# EasyEDA Pro project TB6612-4路电机驱动.epro

# Schematic Schematic1
Board Name: Board1; Create Date: 2025-07-07; Page Name: P1; Project Name: TB6612-4路电机驱动; Schematic Name: Schematic1; Update Date: 2025-07-07; Company: 嘉立创EDA; Page Size: A4; Version: V1.0
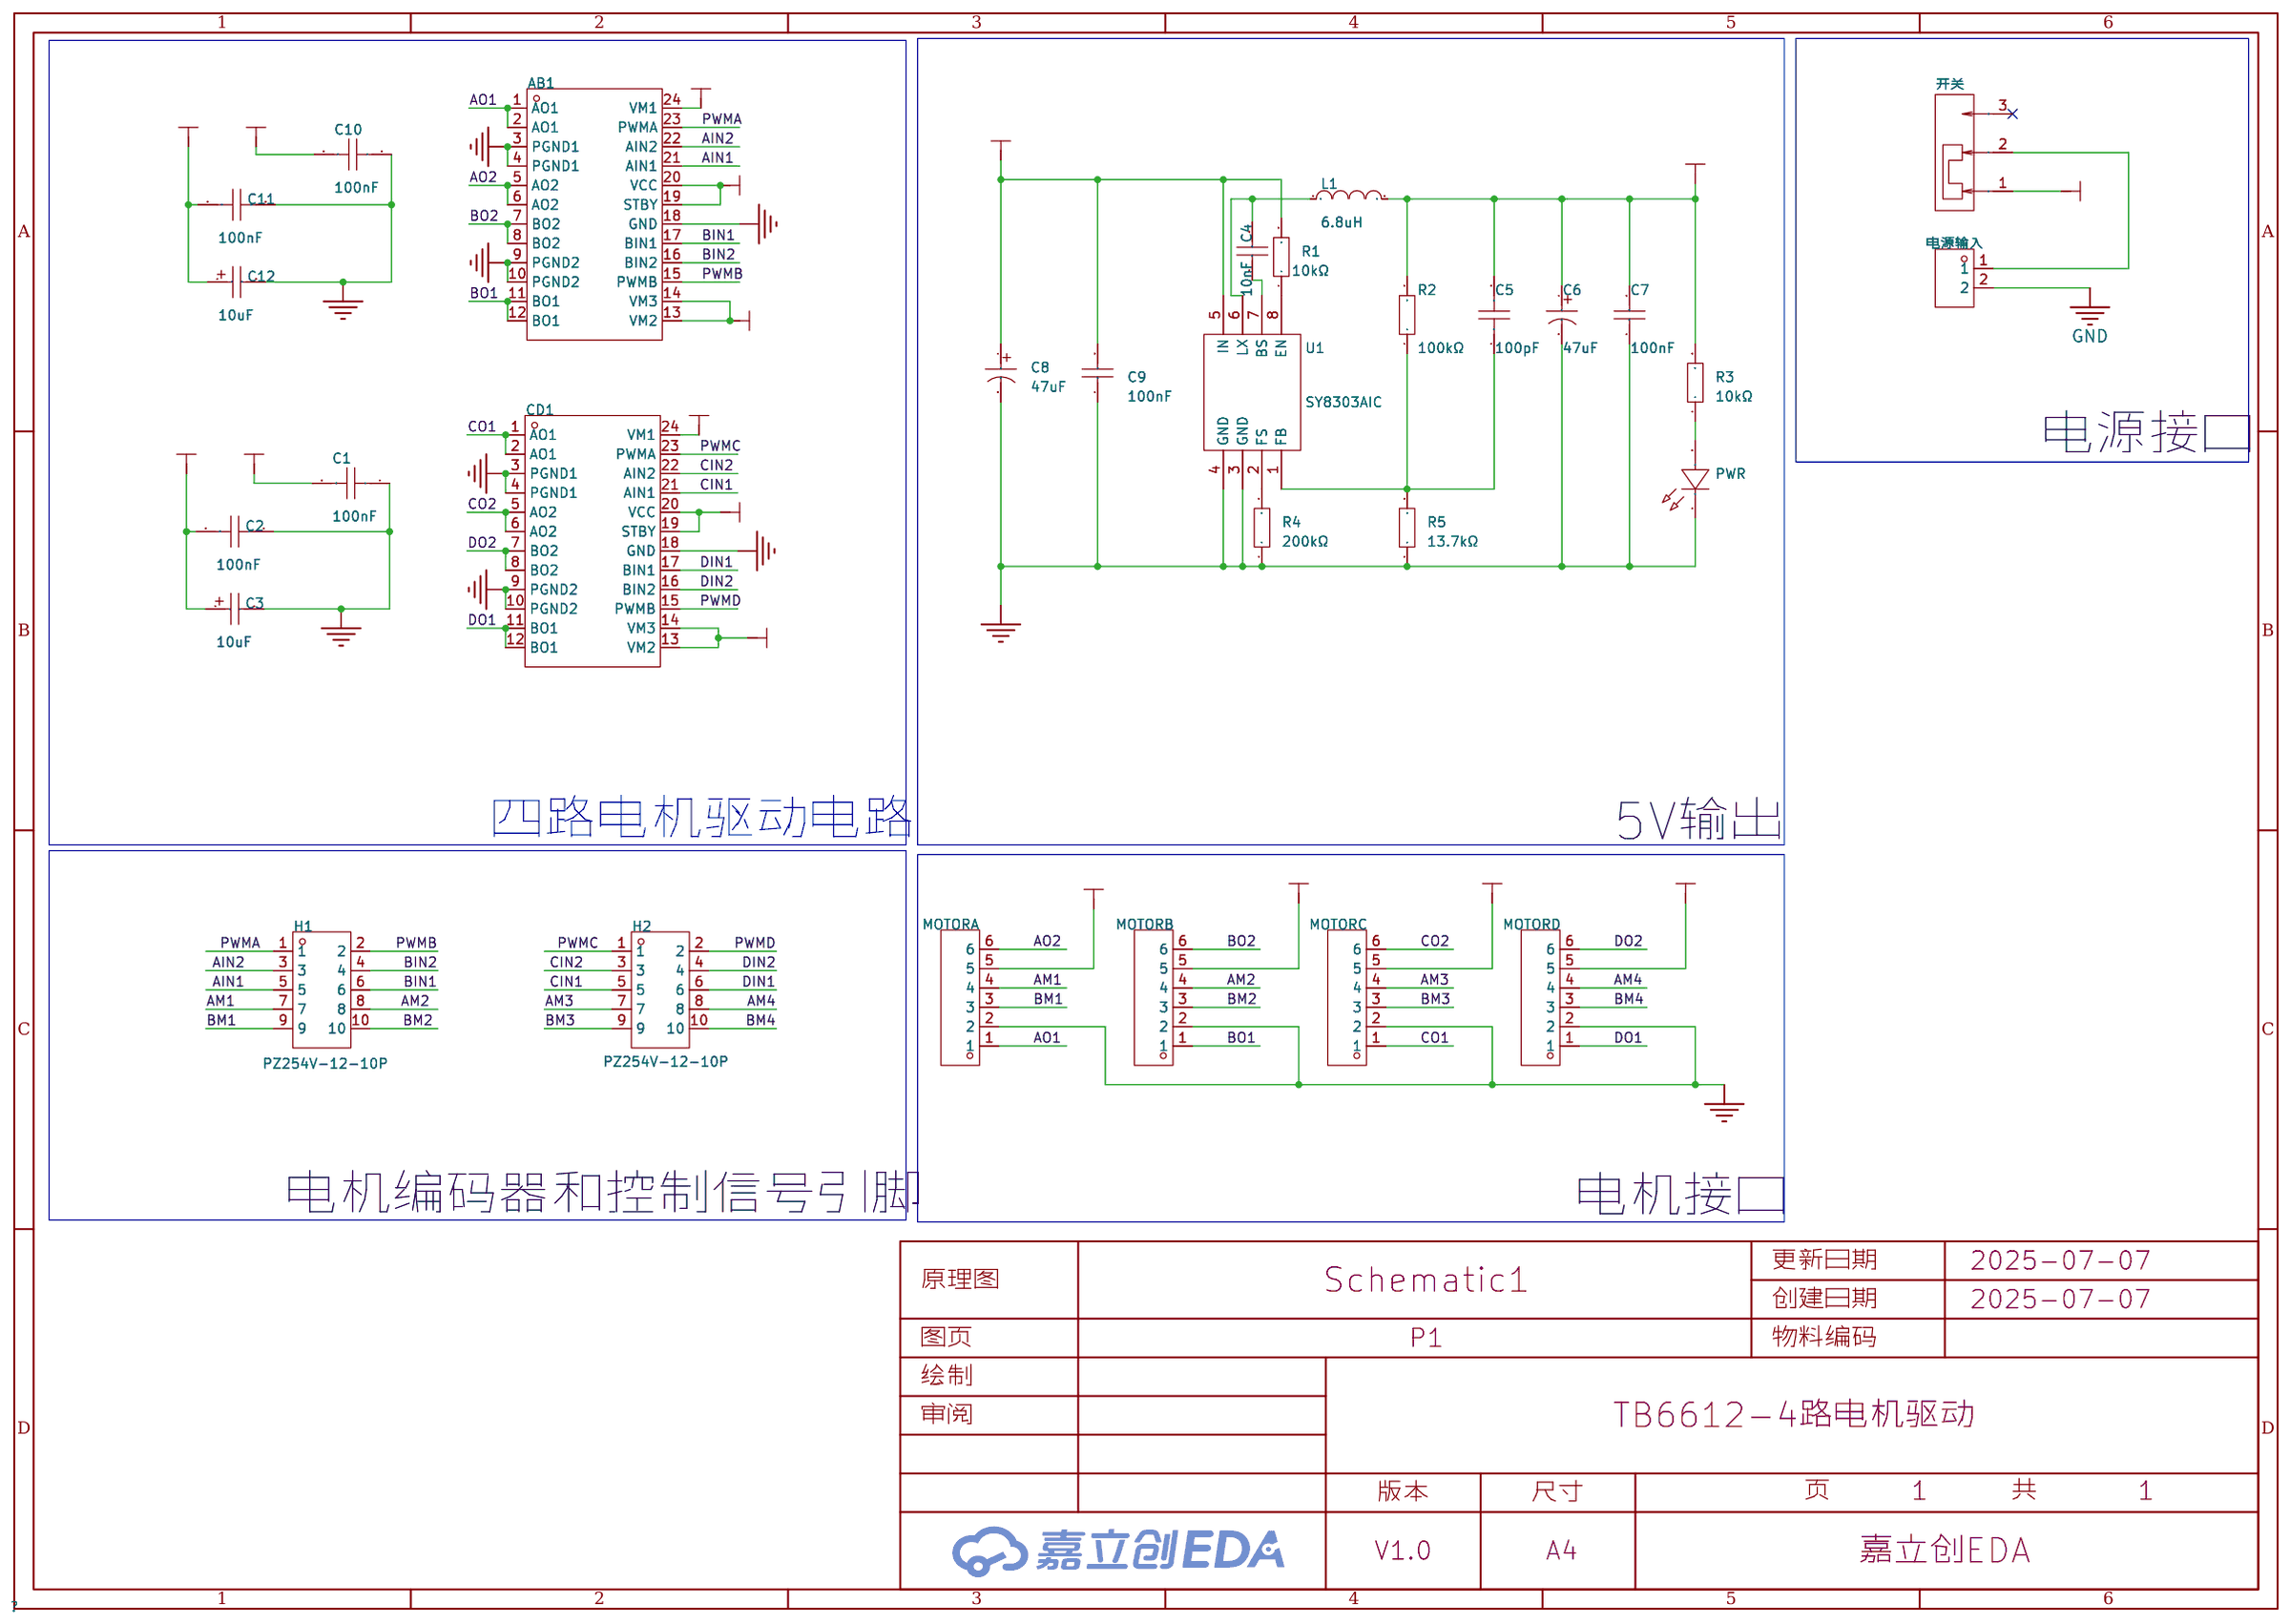
[diagram p0: schematic sheet]

## Parts
AB1  TB6612FNG(O,C,8,EL  [SSOP-24_L8.4-W5.8-P0.65-LS7.8-BL]
C1  100nF  [C0603]
C2  100nF  [C0603]
C3  10uF  [CAP-SMD_L3.5-W2.8-R-RD]
C4  10nF  [C0603]
C5  100pF  [C0603]
C6  47uF  [CAP-SMD_BD6.3-L6.6-W6.6-LS7.6-FD]
C7  100nF  [C0603]
C8  47uF  [CAP-SMD_BD6.3-L6.6-W6.6-LS7.6-FD]
C9  100nF  [C0603]
C10  100nF  [C0603]
C11  100nF  [C0603]
C12  10uF  [CAP-SMD_L3.5-W2.8-R-RD]
CD1  TB6612FNG(O,C,8,EL  [SSOP-24_L8.4-W5.8-P0.65-LS7.8-BL]
H1  PZ254V-12-10P  [HDR-TH_10P-P2.54-V-M-R2-C5-S2.54]
H2  PZ254V-12-10P  [HDR-TH_10P-P2.54-V-M-R2-C5-S2.54]
L1  6.8uH  [IND-SMD_L4.4-W4.2]
MOTORA  X8821WR-06S-N0SN  [CONN-TH_6P-P2.50_X8821WR-06S-N2SN]
MOTORB  X8821WR-06S-N0SN  [CONN-TH_6P-P2.50_X8821WR-06S-N2SN]
MOTORC  X8821WR-06S-N0SN  [CONN-TH_6P-P2.50_X8821WR-06S-N2SN]
MOTORD  X8821WR-06S-N0SN  [CONN-TH_6P-P2.50_X8821WR-06S-N2SN]
PWR  XL-1608UGC-04  [LED0603-RD_GREEN]
R1  10kΩ  [R0603]
R2  100kΩ  [R0603]
R3  10kΩ  [R0603]
R4  200kΩ  [R0603]
R5  13.7kΩ  [R0603]
U1  SY8303AIC  [TSOT-23-8_L2.9-W1.6-P0.65-LS2.8-BR]
开关  SS-12D10-G5  [SW-TH_SS-12D10-G050]
电源输入  KF301-5.0-2P  [CONN-TH_P5.00_KF301-5.0-2P]

## Library data of the parts
AB1 CD1 = TB6612FNG(O,C,8,EL: 双直流电机驱动器集成电路; Supplier Part: C88224; Manufacturer: TOSHIBA(东芝); Supplier Footprint: SSOP-24-208mil; JLCPCB Part Class: 扩展库; Datasheet: https://atta.szlcsc.com/upload/public/pdf/source/20171128/C141517_15118625624231147036.pdf; Supplier: LCSC
C1 C2 C10 C11 = CL10B104KB8NNNC: 容值:100nF;精度:±10%;额定电压:50V;材质(温度系数):X7R;; LCSC Part Name: 100nF ±10% 50V; Supplier Part: C1591; Manufacturer: SAMSUNG(三星); Supplier Footprint: 0603; JLCPCB Part Class: 扩展库; Datasheet: https://atta.szlcsc.com/upload/public/pdf/source/20160218/1457707763339.pdf; Supplier: LCSC; Tolerance: ±10%; Voltage Rated: 50V; Temperature Coefficient: X7R
C3 C12 = TAJB106K025RNJ: 容值:10uF;精度:±10%;额定电压:25V;等效串联电阻:2.5Ω@100kHz;; LCSC Part Name: 10uF ±10% 25V; Supplier Part: C7194; Manufacturer: Kyocera AVX; Supplier Footprint: CASE-B-3528; JLCPCB Part Class: 扩展库; Datasheet: https://atta.szlcsc.com/upload/public/pdf/source/20160107/1457707750344.pdf; Supplier: LCSC; Tolerance: ±10%; Rated Voltage: 25V; Equivalent Series Resistance(ESR): 2.5Ω@100kHz; Operating Temperature: -55℃~+125℃
C4 = CC0603KRX7R9BB103: 容值:10nF;精度:±10%;额定电压:50V;材质(温度系数):X7R;; LCSC Part Name: 10nF ±10% 50V; Supplier Part: C100042; Manufacturer: YAGEO(国巨); Supplier Footprint: 0603; JLCPCB Part Class: 扩展库; Datasheet: https://atta.szlcsc.com/upload/public/pdf/source/20181008/C309510_22F155564471FAF6A489F7D68F34234E.pdf; Supplier: LCSC; Tolerance: ±10%; Voltage Rated: 50V; Temperature Coefficient: X7R
C5 = CC0603JRNPO9BN101: 容值:100pF;精度:±5%;额定电压:50V;材质(温度系数):NP0;; LCSC Part Name: 100pF ±5% 50V; Supplier Part: C14665; Manufacturer: YAGEO(国巨); Supplier Footprint: 0603; JLCPCB Part Class: 扩展库; Datasheet: https://atta.szlcsc.com/upload/public/pdf/source/20181008/C309499_21CC21451B82C39E3D92150FD6B30293.pdf; Supplier: LCSC; Tolerance: ±5%; Voltage Rated: 50V; Temperature Coefficient: NP0
C6 C8 = RVT1H470M0607_C72523: 容值:47uF;精度:±20%;额定电压:50V;纹波电流:66mA@120Hz;等效串联电阻:-;; LCSC Part Name: 47uF ±20% 50V; Supplier Part: C72523; Manufacturer: ROQANG(容强); Manufacturer Part: RVT1H470M0607; Supplier Footprint: SMD,D6.3xL7.7mm; JLCPCB Part Class: 扩展库; Datasheet: https://atta.szlcsc.com/upload/public/pdf/source/20170325/1490427950282.pdf; Supplier: LCSC; Tolerance: ±20%; Rated Voltage: 50V; Ripple Current: 66mA@120Hz; φD: 6.3mm; L: 7.7mm; Lifetime @ Temp: 2000hrs@105℃; Operating Temperature: -40℃~+105℃
C7 C9 = 0603B104K500NT: 容值:100nF;精度:±10%;额定电压:50V;材质(温度系数):X7R;; LCSC Part Name: 100nF ±10% 50V; Supplier Part: C30926; Manufacturer: FH(风华); Supplier Footprint: 0603; JLCPCB Part Class: 扩展库; Datasheet: https://atta.szlcsc.com/upload/public/pdf/source/20200305/C486355_26A10D38EF8C2A5C37091D0039909270.pdf; Supplier: LCSC; Tolerance: ±10%; Voltage Rated: 50V; Temperature Coefficient: X7R
H1 H2 = PZ254V-12-10P: 插针结构:2x5P;间距:2.54mm;行距:2.54mm;圆针/方针:方针;安装类型:直插;排数:双排;总PIN位数:10P;额定电流:-;额定电压:-;配合针长度:6mm;塑高:2.5mm;端接针长度:3mm;触头材质:黄铜;触头镀层:-;工作温度范围:-40℃~+105℃;颜色:黑色;; LCSC Part Name: 间距:2.54mm 2x5P 直插 方针; Supplier Part: C492422; Manufacturer: XFCN(兴飞); Supplier Footprint: 插件,P=2.54mm; JLCPCB Part Class: 扩展库; Datasheet: https://atta.szlcsc.com/upload/public/pdf/source/20200309/C492422_5020CEA01BE7051F9EA9DD81AB0A25E3.pdf; Supplier: LCSC; Pin Structure: 2x5P; Pitch: 2.54mm; Row Spacing: 2.54mm; Circluar Pins/Square Pins: 方针; Mounting Type: 直插; Number of Rows: 双排; Number of Pins: 10P; Length of Mating Pin: 6mm; Insulation Height: 2.5mm; Length of End Connection Pin: 3mm; Contact Material: 黄铜; Operating Temperature Range: -40℃~+105℃; Color: 黑色
L1 = FXL0420-6R8-M: 电感值:6.8uH;精度:±20%;额定电流:2.4A;饱和电流(Isat):2.5A;类型:一体成型电感;; LCSC Part Name: 6.8uH ±20% 2.5A; Supplier Part: C177241; Manufacturer: cjiang(长江微电); Supplier Footprint: SMD,4.2x4.4mm; JLCPCB Part Class: 扩展库; Datasheet: https://atta.szlcsc.com/upload/public/pdf/source/20200117/C485363_A2440626DC7482D75DD0DD56D1883FBF.pdf; Supplier: LCSC; Tolerance: ±20%; Rated Current: 2.4A; Saturation Current (Isat): 2.5A; DC Resistance (DCR): 175mΩ; Type: 一体成型电感
MOTORA MOTORB MOTORC MOTORD = X8821WR-06S-N0SN: 插针结构:1x6P;间距:2.5mm;安装方式:弯插;参考系列:XH;总PIN数:6P;排数:1;每排PIN数:6;行距:-;额定电流:3A;触头材质:黄铜;触头镀层:锡;工作温度范围:-;; LCSC Part Name: 1x6P 间距:2.5mm 弯插 系列:XH; Supplier Part: C388743; Manufacturer: XKB Connection(中国星坤); Supplier Footprint: 弯插,P=2.54mm; JLCPCB Part Class: 扩展库; Datasheet: https://atta.szlcsc.com/upload/public/pdf/source/20211009/984C14C41D2B1156BCF8EEF5D296E395.pdf; Supplier: LCSC; Pins Structure: 1x6P; Pitch: 2.5mm; Mounting Style: 弯插; Reference Series: XH; Number of Pins: 6P; Number of Rows: 1; Number of PINs Per Row: 6; Current Rating (Max): 3A; Contact Material: 黄铜; Contact Plating: 锡
PWR = XL-1608UGC-04: 灯头类型:-;发光颜色:翠绿色;正向电压(VF):-;功率:80mW;正向电流:25mA;主波长:516nm~525nm;二极管配置:独立二极管;透镜颜色:无色透明透镜;色温:-;发光强度:-;发光角度:120°;载带方式:正贴;工作温度:-30℃~+85℃;; Supplier Part: C965804; Manufacturer: XINGLIGHT(成兴光); Supplier Footprint: 0603; JLCPCB Part Class: 扩展库; Datasheet: https://atta.szlcsc.com/upload/public/pdf/source/20221102/520D6E465E5CFD1609C8A4DBC80D4018.pdf; Supplier: LCSC; Emitted Color: 翠绿色; Power Dissipation: 80mW; Forward Current: 25mA; Dominant Wavelength: 516nm~525nm; Peak Wavelength: 534nm; Diode Configuration: 独立二极管; Lens Color: 无色透明透镜; Viewing Angle: 120°; Mounting Sytle: 正贴; Operating Temperature: -30℃~+85℃
R1 R3 = 0603WAF1002T5E: 电阻类型:厚膜电阻;阻值:10kΩ;精度:±1%;功率:100mW;最大工作电压:75V;温度系数:±100ppm/℃;; LCSC Part Name: 厚膜电阻 10kΩ ±1% 100mW; Supplier Part: C25804; Manufacturer: UNI-ROYAL(厚声); Supplier Footprint: 0603; JLCPCB Part Class: 基础库; Datasheet: https://atta.szlcsc.com/upload/public/pdf/source/20200306/C422600_1E6D84923E4A46A82E41ADD87F860B5C.pdf; Supplier: LCSC; Type: 厚膜电阻; Tolerance: ±1%; Power(Watts): 100mW; Overload Voltage (Max): 75V; Temperature Coefficient: ±100ppm/℃; Operating Temperature Range: -55℃~+155℃
R2 = 0603WAF1003T5E: 电阻类型:厚膜电阻;阻值:100kΩ;精度:±1%;功率:100mW;最大工作电压:75V;温度系数:±100ppm/℃;; LCSC Part Name: 100kΩ ±1% 100mW 厚膜电阻; Supplier Part: C25803; Manufacturer: UNI-ROYAL(厚声); Supplier Footprint: 0603; JLCPCB Part Class: 基础库; Datasheet: https://atta.szlcsc.com/upload/public/pdf/source/20200306/C422600_1E6D84923E4A46A82E41ADD87F860B5C.pdf; Supplier: LCSC; Type: 厚膜电阻; Tolerance: ±1%; Power(Watts): 100mW; Overload Voltage (Max): 75V; Temperature Coefficient: ±100ppm/℃; Operating Temperature Range: -55℃~+155℃
R4 = 0603WAF2003T5E: 电阻类型:厚膜电阻;阻值:200kΩ;精度:±1%;功率:100mW;最大工作电压:75V;温度系数:±100ppm/℃;; LCSC Part Name: 200kΩ ±1% 100mW 厚膜电阻; Supplier Part: C25811; Manufacturer: UNI-ROYAL(厚声); Supplier Footprint: 0603; JLCPCB Part Class: 基础库; Datasheet: https://atta.szlcsc.com/upload/public/pdf/source/20200306/C422600_1E6D84923E4A46A82E41ADD87F860B5C.pdf; Supplier: LCSC; Type: 厚膜电阻; Tolerance: ±1%; Power(Watts): 100mW; Overload Voltage (Max): 75V; Temperature Coefficient: ±100ppm/℃; Operating Temperature Range: -55℃~+155℃
R5 = 0603WAF1372T5E: 电阻类型:厚膜电阻;阻值:13.7kΩ;精度:±1%;功率:100mW;最大工作电压:75V;温度系数:±100ppm/℃;; LCSC Part Name: 13.7kΩ ±1% 100mW 厚膜电阻; Supplier Part: C22793; Manufacturer: UNI-ROYAL(厚声); Supplier Footprint: 0603; JLCPCB Part Class: 扩展库; Datasheet: https://atta.szlcsc.com/upload/public/pdf/source/20200306/C422600_1E6D84923E4A46A82E41ADD87F860B5C.pdf; Supplier: LCSC; Type: 厚膜电阻; Tolerance: ±1%; Power(Watts): 100mW; Overload Voltage (Max): 75V; Temperature Coefficient: ±100ppm/℃; Operating Temperature Range: -55℃~+155℃
U1 = SY8303AIC: 功能类型:降压型;输入电压:-;输出电流(最大值):-;; Supplier Part: C97054; Manufacturer: silergy(矽力杰); Supplier Footprint: TSOT-23-8; JLCPCB Part Class: 扩展库; Datasheet: https://atta.szlcsc.com/upload/public/pdf/source/20170308/1488958431714.pdf; Supplier: LCSC; Function: 降压型; Switch tube (built-in/external): 内置
开关 = SS-12D10-G5: 电路结构:单刀双掷;安装方式:直插;开关颜色:黑色;滑钮形状:矩形柱状;引脚样式:PC引脚;开关长度:12.7mm;开关宽度:6.7mm;开关高度:11.3mm;; LCSC Part Name: 插件大电流拨动开关; Supplier Part: C2998777; Manufacturer: DEALON(德艺隆); Supplier Footprint: 插件; JLCPCB Part Class: Extended Part; Datasheet: https://atta.szlcsc.com/upload/public/pdf/source/20220428/E10CB334ACBAF32CF4AF8D87DA871CD3.pdf; Supplier: LCSC; Circuit: 单刀双掷; Mounting Style: 直插; Actuator Color: 黑色; Actuator Style: 矩形柱状; Pin Style: PC引脚; Switch Length: 12.7mm; Switch Width: 6.7mm; Switch Height: 11.3mm
电源输入 = KF301-5.0-2P: 结构:1x2P;间距:5mm;颜色:蓝色;安装方式:直插;额定电流:17A;额定电压:250V;排数:1;线规 - AWG:14~22;线规 - 平方毫米:1.5;每排PIN数:2;工作温度范围:-30℃~+120℃;; LCSC Part Name: 5mm 1x2P 排数:1 每排P数:2 直插; Supplier Part: C474881; Manufacturer: KEFA(科发); Supplier Footprint: 插件,P=5mm; JLCPCB Part Class: 扩展库; Datasheet: https://atta.szlcsc.com/upload/public/pdf/source/20230317/03A5B5FC229D6F9225E8F51DA1A4E80A.pdf; Supplier: LCSC; Structure: 1x2P; Pitch: 5mm; Color: 蓝色; Mounting Style: 直插; Current Rating (Max): 17A; Voltage Rating (Max): 250V; Number of Pins: 2P; Number of Rows: 1; Wire Gauge - AWG: 14~22; Wire Gauge - mm2: 1.5; Number of PINs Per Row: 2; Operating Temperature Range: -30℃~+120℃

## Nets
5V: AB1.19(STBY) AB1.20(VCC) C1.2 C5.2 C6.1 C7.2 C10.2 CD1.19(STBY) CD1.20(VCC) L1.2 MOTORA.5 MOTORB.5 MOTORC.5 MOTORD.5 R2.2 R3.2
12V: AB1.13(VM2) AB1.14(VM3) AB1.24(VM1) C2.2 C3.1 C8.1 C9.2 C11.2 C12.1 CD1.13(VM2) CD1.14(VM3) CD1.24(VM1) R1.2 U1.5(IN) 开关.1
GND: AB1.3(PGND1) AB1.4(PGND1) AB1.9(PGND2) AB1.10(PGND2) AB1.18(GND) C1.1 C2.1 C3.2 C6.2 C7.1 C8.2 C9.1 C10.1 C11.1 C12.2 CD1.3(PGND1) CD1.4(PGND1) CD1.9(PGND2) CD1.10(PGND2) CD1.18(GND) MOTORA.2 MOTORB.2 MOTORC.2 MOTORD.2 PWR.1(K) R4.1 R5.1 U1.3(GND) U1.4(GND) 电源输入.2
AIN1: AB1.21(AIN1) H1.5
AIN2: AB1.22(AIN2) H1.3
AM1: H1.7 MOTORA.4
AM2: H1.8 MOTORB.4
AM3: H2.7 MOTORC.4
AM4: H2.8 MOTORD.4
AO1: AB1.1(AO1) AB1.2(AO1) MOTORA.1
AO2: AB1.5(AO2) AB1.6(AO2) MOTORA.6
BIN1: AB1.17(BIN1) H1.6
BIN2: AB1.16(BIN2) H1.4
BM1: H1.9 MOTORA.3
BM2: H1.10 MOTORB.3
BM3: H2.9 MOTORC.3
BM4: H2.10 MOTORD.3
BO1: AB1.11(BO1) AB1.12(BO1) MOTORB.1
BO2: AB1.7(BO2) AB1.8(BO2) MOTORB.6
CIN1: CD1.21(AIN1) H2.5
CIN2: CD1.22(AIN2) H2.3
CO1: CD1.1(AO1) CD1.2(AO1) MOTORC.1
CO2: CD1.5(AO2) CD1.6(AO2) MOTORC.6
DIN1: CD1.17(BIN1) H2.6
DIN2: CD1.16(BIN2) H2.4
DO1: CD1.11(BO1) CD1.12(BO1) MOTORD.1
DO2: CD1.7(BO2) CD1.8(BO2) MOTORD.6
PWMA: AB1.23(PWMA) H1.1
PWMB: AB1.15(PWMB) H1.2
PWMC: CD1.23(PWMA) H2.1
PWMD: CD1.15(PWMB) H2.2
$1N2942: C4.1 U1.7(BS)
$1N2945: R4.2 U1.2(FS)
$1N2946: R1.1 U1.8(EN)
$1N2947: C4.2 L1.1 U1.6(LX)
$1N2949: C5.1 R2.1 R5.2 U1.1(FB)
$1N2950: PWR.2(A) R3.1
$1N3073: 开关.2 电源输入.1

Not connected (* = marked no-connect by the designer): 开关 3*

## Notes on the sheet
- 电源接口
- 四路电机驱动电路
- 5V输出
- 电机编码器和控制信号引脚
- 电机接口

# Board PCB1
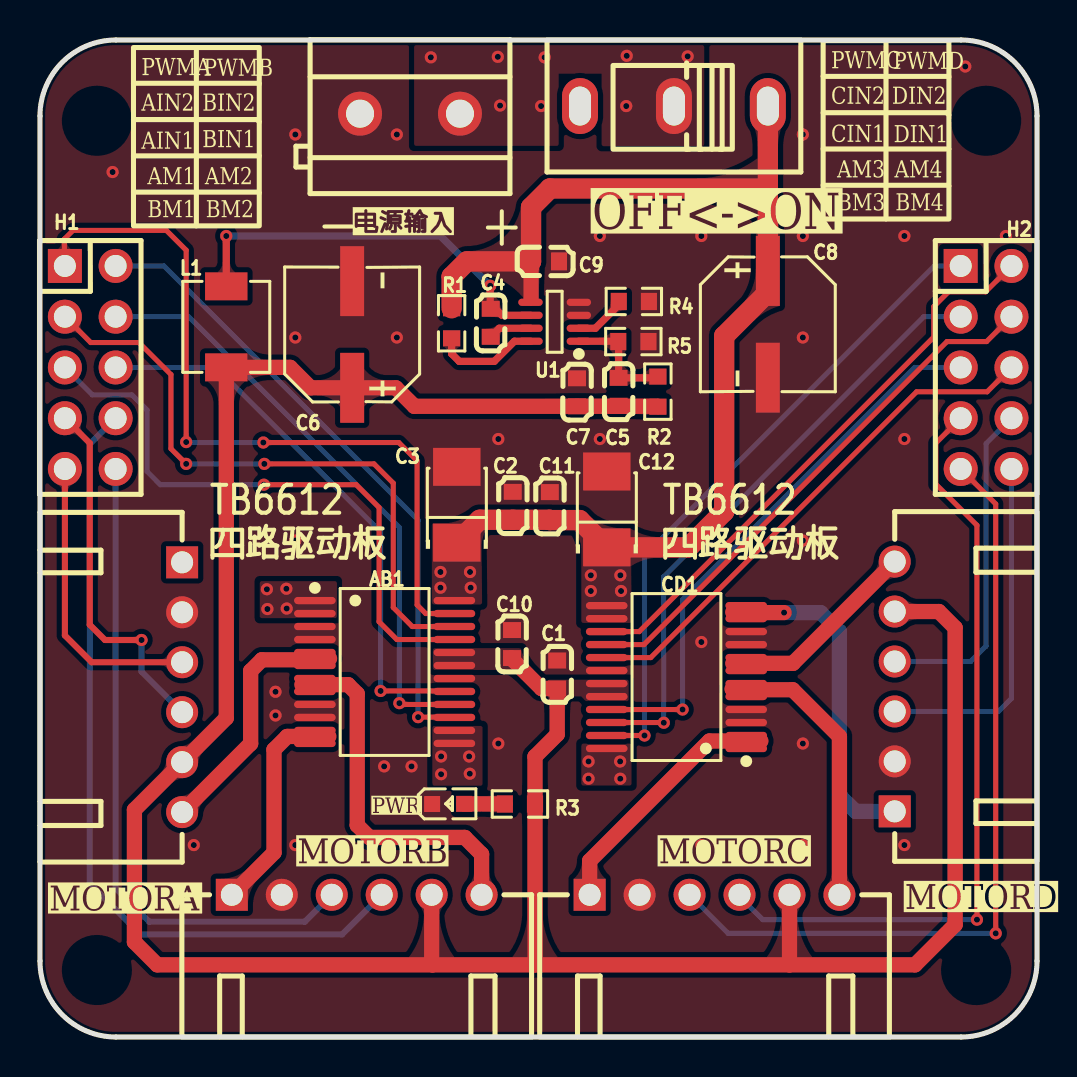
[diagram p1: board, top side]
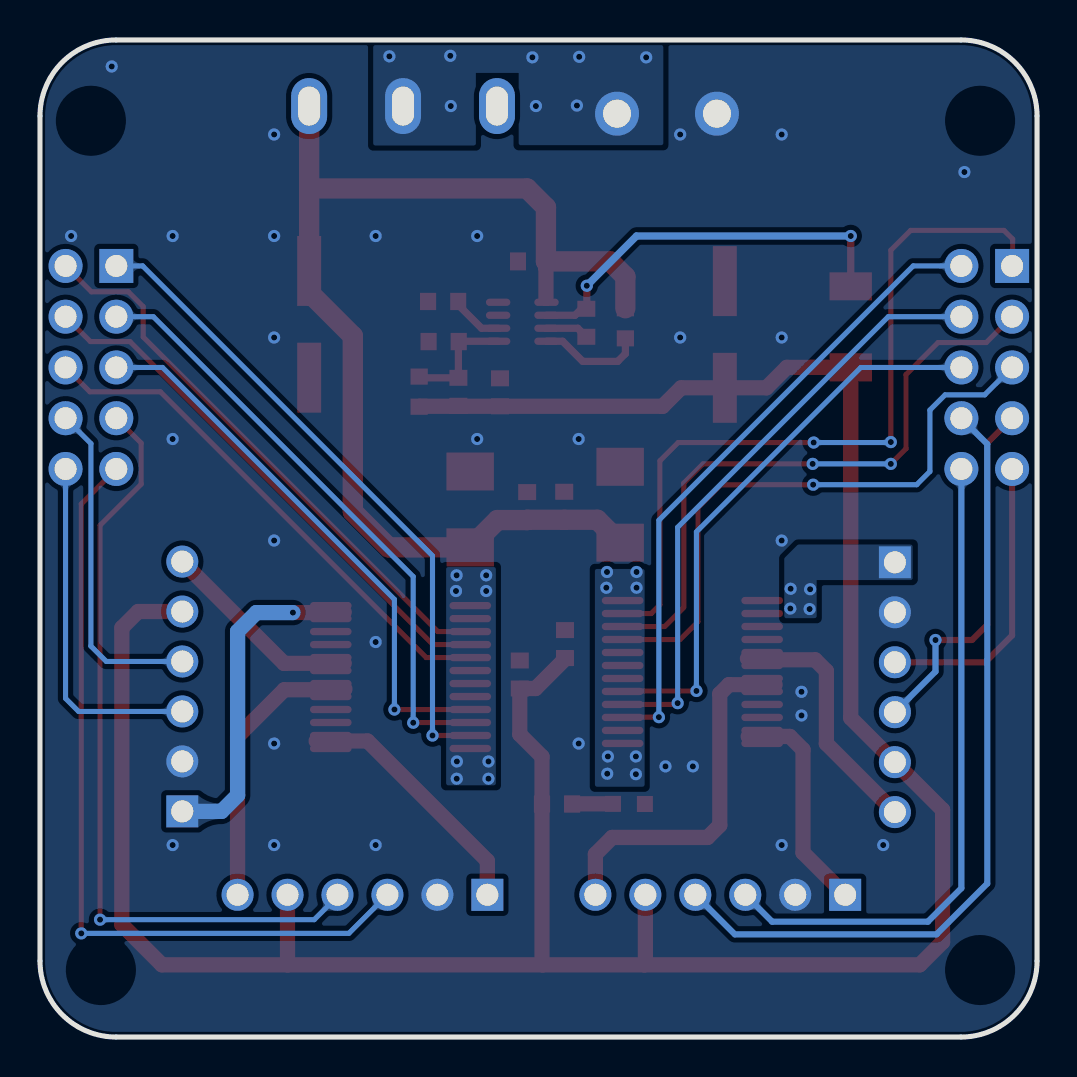
[diagram p2: board, bottom side, seen from below]

Outline 49.9 x 49.9 mm; copper layers: Top Layer, Bottom Layer. Coordinates in mm from the lower left corner of the outline.
Outline path: 0,46.09 arc(1.12,48.78) 3.81,49.9 46.09,49.9 arc(48.78,48.78) 49.9,46.09 49.9,3.81 arc(48.78,1.12) 46.09,0 3.81,0 arc(1.12,1.12) 0,3.81 0,46.09
Stack: Top Layer 0.035mm / Dielectric1 1.51mm FR4 er 4.5 / Bottom Layer 0.035mm

## Design rules (mm)
template: 自定义配置
spacing copperThickness1oz (default): track to track 0.102, other pairs 0.152 to 0.3
spacing copperThickness2oz: track to track 0.203, other pairs 0.152 to 0.3
track width copperThickness1oz (default): min 0.127, default 0.254, max 2.54
track width copperThickness2oz: min 0.203, default 0.254, max 2.54
differential pair differentialPair (default): width min 0.127, default 0.254, max 2.54; gap min 0.152, default 0.152
via viaSize (default): diameter min 0.5, default 0.61, max 10; hole min 0.3, default 0.305, max 6.3

## Placement (name value [footprint] x y rotation side)
AB1  TB6612FNG(O,C,8,EL  [SSOP-24_L8.4-W5.8-P0.65-LS7.8-BL]  17.25 18.27 270 top
C1  100nF  [C0603]  25.89 18.14 270 top
C2  100nF  [C0603]  23.66 26.59 270 top
C3  10uF  [CAP-SMD_L3.5-W2.8-R-RD]  20.86 26.64 270 top
C4  10nF  [C0603]  22.56 35.74 90 top
C5  100pF  [C0603]  28.96 32.29 270 top
C6  47uF  [CAP-SMD_BD6.3-L6.6-W6.6-LS7.6-FD]  15.62 35.16 90 top
C7  100nF  [C0603]  26.88 32.26 270 top
C8  47uF  [CAP-SMD_BD6.3-L6.6-W6.6-LS7.6-FD]  36.43 35.67 270 top
C9  100nF  [C0603]  25.28 38.82 180 top
C10  100nF  [C0603]  23.62 19.67 270 top
C11  100nF  [C0603]  25.52 26.57 270 top
C12  10uF  [CAP-SMD_L3.5-W2.8-R-RD]  28.37 26.4 270 top
CD1  TB6612FNG(O,C,8,EL  [SSOP-24_L8.4-W5.8-P0.65-LS7.8-BL]  31.85 18.02 90 top
H1  PZ254V-12-10P  [HDR-TH_10P-P2.54-V-M-R2-C5-S2.54]  2.52 33.51 270 top
H2  PZ254V-12-10P  [HDR-TH_10P-P2.54-V-M-R2-C5-S2.54]  47.35 33.51 270 top
L1  6.8uH  [IND-SMD_L4.4-W4.2]  9.32 35.54 90 top
MOTORA  X8821WR-06S-N0SN  [CONN-TH_6P-P2.50_X8821WR-06S-N2SN]  7.11 17.51 270 top
MOTORB  X8821WR-06S-N0SN  [CONN-TH_6P-P2.50_X8821WR-06S-N2SN]  15.85 7.12 0 top
MOTORC  X8821WR-06S-N0SN  [CONN-TH_6P-P2.50_X8821WR-06S-N2SN]  33.76 7.12 0 top
MOTORD  X8821WR-06S-N0SN  [CONN-TH_6P-P2.50_X8821WR-06S-N2SN]  42.78 17.54 90 top
PWR  XL-1608UGC-04  [LED0603-RD_GREEN]  20.42 11.67 0 top
R1  10kΩ  [R0603]  20.6 35.72 90 top
R2  100kΩ  [R0603]  30.92 32.3 270 top
R3  10kΩ  [R0603]  24.02 11.66 0 top
R4  200kΩ  [R0603]  29.72 36.81 180 top
R5  13.7kΩ  [R0603]  29.7 34.8 180 top
U1  SY8303AIC  [TSOT-23-8_L2.9-W1.6-P0.65-LS2.8-BR]  25.76 35.8 0 top
开关  SS-12D10-G5  [SW-TH_SS-12D10-G050]  31.73 46.59 180 top
电源输入  KF301-5.0-2P  [CONN-TH_P5.00_KF301-5.0-2P]  18.52 46.21 180 top

## Footprints (pads in the part's own frame, mm; a bottom-side part is the same pattern mirrored in y, then rotated)
C0603
  rect 0.8x0.9 smd: 1(-0.7,0) 2(0.7,0)
CAP-SMD_BD6.3-L6.6-W6.6-LS7.6-FD
  rect 3.5x1.2 smd: 1(-2.67,0) 2(2.67,0)
CAP-SMD_L3.5-W2.8-R-RD
  rect 1.9x2.376 smd: 1(1.899,0) 2(-1.899,0)
CONN-TH_6P-P2.50_X8821WR-06S-N2SN
  rect 1.6x1.6 hole 1.1: 1(-6.25,0)
  round 1.6 hole 1.1: 2(-3.75,0) 3(-1.25,0) 4(1.25,0) 5(3.75,0) 6(6.25,0)
CONN-TH_P5.00_KF301-5.0-2P
  round 2.2 hole 1.4: 1(-2.5,0) 2(2.5,0)
HDR-TH_10P-P2.54-V-M-R2-C5-S2.54
  rect 1.7x1.7 hole 1.1: 1(-5.08,-1.27)
  round 1.7 hole 1.1: 2(-5.08,1.27) 3(-2.54,-1.27) 4(-2.54,1.27) 5(0,-1.27) 6(0,1.27) 7(2.54,-1.27) 8(2.54,1.27) 9(5.08,-1.27) 10(5.08,1.27)
IND-SMD_L4.4-W4.2
  rect 1.4x2.12 smd: 1(2.028,0) 2(-2.028,0)
LED0603-RD_GREEN
  rect 0.8x0.8 smd: 1(-0.799,-0.004) 2(0.799,0.004)
R0603
  rect 0.806x0.864 smd: 1(-0.753,0) 2(0.753,0)
SSOP-24_L8.4-W5.8-P0.65-LS7.8-BL
  oval 0.364x2.082 smd: 1(-3.575,-3.491) 2(-2.925,-3.491) 3(-2.275,-3.491) 4(-1.625,-3.491) 5(-0.975,-3.491) 6(-0.325,-3.491) 7(0.325,-3.491) 8(0.975,-3.491) 9(1.625,-3.491) 10(2.275,-3.491) 11(2.925,-3.491) 12(3.575,-3.491) 13(3.575,3.491) 14(2.925,3.491) 15(2.275,3.491) 16(1.625,3.491) 17(0.975,3.491) 18(0.325,3.491) 19(-0.325,3.491) 20(-0.975,3.491) 21(-1.625,3.491) 22(-2.275,3.491) 23(-2.925,3.491) 24(-3.575,3.491)
SW-TH_SS-12D10-G050
  oval 1.8x2.8 hole 1.1x1.95: 1(-4.7,0) 2(0,0) 3(4.7,0)
TSOT-23-8_L2.9-W1.6-P0.65-LS2.8-BR
  oval 1.222x0.364 smd: 1(1.211,-0.975) 2(1.211,-0.325) 3(1.211,0.325) 4(1.211,0.975) 5(-1.211,0.975) 6(-1.211,0.325) 7(-1.211,-0.325) 8(-1.211,-0.975)

## Nets
As in the schematic.

Pads without a net: 开关 3

## Via types
v1: diameter 0.61, hole 0.305, Top Layer to Bottom Layer, 75 vias

## Routing (per net, layer and track width the routed paths; a pad name or vN(x,y) marks a point on that pad's centre or on a via; arc(x,y) is an arc through that point)
5V: length 138
  Top Layer w0.762: R2.2 30.9,31.56 C7.2 18.74,31.56 17.81,32.49 C6.1 13.54,32.49 12.52,33.51 9.32,33.51 9.32,15.97 MOTORA.5 4.73,11.37 4.73,4.76 5.87,3.61 19.65,3.61 ; MOTORC.5 37.51,3.61 ; MOTORB.5 19.6,3.66 19.65,3.61 ; 24.74,3.61 43.79,3.61 45.8,5.62 45.8,20.48 44.98,21.29 MOTORD.5 ; 24.74,3.61 19.65,3.61 ; 24.74,3.61 24.77,3.64 R3.2 24.77,14.03 25.89,15.15 C1.2 25.1,17.44 23.57,18.97 C10.2
12V: length 59
  Top Layer w0.762: C9.2 24.58,36.99
  Top Layer w1.016: C3.1 22.01,25.89 C2.2 25.5,25.89 C11.2 27,25.87 C12.1 32.45,24.51 34.24,26.3 34.24,35.08 36.43,37.27 C8.1 36.43,42.47 ; 36.43,42.47 25.52,42.47 24.58,41.52 C9.2 21.36,38.82 20.6,38.06 R1.2 ; 36.43,42.47 开关.1
  vias: v1(20.04,23.27) v1(20.04,22.49) v1(20.08,14.04) v1(20.08,13.15) v1(21.48,14.04) v1(21.52,23.27) v1(21.55,22.49) v1(21.51,13.18) v1(27.45,13.79) v1(27.45,12.93) v1(27.57,23.11) v1(27.57,22.32) v1(29.05,23.11) v1(29.08,22.32) v1(29.03,13.79) v1(29.04,12.93)
GND:
  vias: v1(3.64,43.29) v1(7.7,9.61) v1(11.79,17.28) v1(11.79,16.09) v1(12.78,45.17) v1(12.78,35.01) v1(12.78,24.85) v1(12.78,9.61) v1(17.22,13.54) v1(17.86,45.17) v1(17.86,35.01) v1(18.6,13.54) v1(22.94,29.93) v1(22.94,14.69) v1(28.02,40.09) v1(28.02,29.93) v1(33.1,40.09) v1(33.1,19.77) v1(33.1,9.61) v1(38.18,45.17) v1(38.18,40.09) v1(38.18,35.01) v1(38.18,24.85) v1(38.18,14.69) v1(38.18,9.61) v1(43.26,40.09) v1(43.26,29.93) v1(43.26,9.61) v1(46.31,48.57) v1(48.34,40.09)
AIN1: length 30.3
  Top Layer w0.254: AB1.21 17.86,19.89 16.97,20.78 16.97,26.5 15.83,27.64 v1(11.2,27.64)
  Bottom Layer w0.254: H1.5 2.62,32.14 4.6,32.14 5.36,31.38 5.36,28.3 6.02,27.64 v1(11.2,27.64)
AIN2: length 31.7
  Top Layer w0.254: AB1.22 18.63,20.54 17.68,21.5 17.68,27.72 16.72,28.68 v1(11.23,28.68) ; v1(7.32,28.68) 6.56,29.45 6.56,33.15 4.95,34.76 2.54,34.76 H1.3
  Bottom Layer w0.254: v1(11.23,28.68) v1(7.32,28.68)
AM1: length 18.2
  Top Layer w0.305: v1(5.08,19.87) 3.25,19.87 2.49,20.63 2.49,29.72 H1.7
  Bottom Layer w0.305: MOTORA.4 5.08,18.29 v1(5.08,19.87)
AM2: length 40.3
  Bottom Layer w0.305: H1.8 2.49,29.67 2.49,7.68 5.03,5.14 15.12,5.14 MOTORB.4
AM3: length 38.9
  Top Layer w0.254: H2.7 44.83,29.72 44.83,27.67 46.89,25.61 v1(46.89,5.87)
  Bottom Layer w0.254: v1(46.89,5.87) 36.17,5.87 35.01,7.04 MOTORC.4
AM4: length 16.8
  Bottom Layer w0.254: MOTORD.4 46.58,18.79 47.35,19.56 47.35,29.7 H2.8
AO1:
  vias: v1(11.36,22.41) v1(11.38,21.42) v1(12.33,22.43) v1(12.35,21.44)
AO2: length 12.7
  Top Layer w0.762: 14.49,18.94 14.43,18.88 11.1,18.88 10.54,18.32 10.54,14.69 MOTORA.6
BIN1: length 28.3
  Top Layer w0.254: AB1.17 20.71,17.32 v1(17.05,17.32)
  Bottom Layer w0.254: v1(17.05,17.32) 17.05,25.28 8.82,33.51 H1.6
BIN2: length 30.1
  Top Layer w0.254: AB1.16 18.05,16.64 v1(17.99,16.71)
  Bottom Layer w0.254: H1.4 7.44,36.05 17.99,25.51 v1(17.99,16.71)
BM1: length 14.8
  Top Layer w0.305: MOTORA.3 2.59,18.76 1.25,20.1 H1.9
BM2: length 33
  Bottom Layer w0.305: MOTORB.3 13.26,5.77 5.46,5.77 3.79,7.45 H1.10
BM3: length 40.1
  Top Layer w0.254: v1(47.83,5.19) 47.83,26.68 H2.9
  Bottom Layer w0.254: v1(47.83,5.19) 34.44,5.19 MOTORC.3
BM4: length 17.6
  Bottom Layer w0.254: H2.10 48.62,16.95 47.96,16.29 MOTORD.3
BO1: length 11.2
  Top Layer w0.762: 14.46,15.04 12.37,15.04 11.71,14.38 11.71,9.23 MOTORB.1
BO2: length 18.4
  Top Layer w0.762: MOTORB.6 22.1,9.15 21.26,9.99 16.49,9.99 15.88,10.6 15.88,17.18 15.42,17.63 13.11,17.63
CIN1: length 28
  Top Layer w0.254: CD1.21 v1(32.16,16.39)
  Bottom Layer w0.254: H2.5 43.77,33.51 32.16,21.9 v1(32.16,16.39)
CIN2: length 30.4
  Top Layer w0.254: CD1.22 31.21,15.74 v1(31.22,15.73)
  Bottom Layer w0.254: H2.3 44.22,36.05 31.22,23.04 v1(31.22,15.73)
CO1: length 12.8
  Top Layer w0.762: MOTORC.1 27.51,8.82 33.51,14.81 36.08,14.81
CO2: length 14.3
  Top Layer w0.762: 34.64,17.42 34.67,17.38 37.67,17.38 40.01,15.04 MOTORC.6
DIN1: length 26.3
  Top Layer w0.254: CD1.17 30.57,18.99 43.87,32.29 47.4,32.29 H2.6
DIN2: length 27.1
  Top Layer w0.254: H2.4 47.37,34.8 45.39,34.8 30.23,19.64 CD1.16
DO1: length 17
  Top Layer w0.762: 34.67,21.27 34.7,21.24 v1(37.24,21.24)
  Bottom Layer w0.762: v1(37.24,21.24) 39.07,21.24 40.01,20.3 40.01,12.1 40.81,11.29 MOTORD.1
DO2: length 10.2
  Top Layer w0.762: MOTORD.6 37.68,18.7 34.67,18.7
PWMA: length 38.8
  Top Layer w0.254: H1.1 1.22,38.62 1.22,39.93 1.65,40.37 6.33,40.37 7.32,39.38 v1(7.32,29.78) ; AB1.23 19.3,21.19 18.87,21.62 18.87,28.84 17.96,29.75 v1(11.18,29.75)
  Bottom Layer w0.254: v1(7.32,29.78) 7.34,29.75 v1(11.18,29.75)
PWMB: length 32.1
  Top Layer w0.254: AB1.15 20.73,16.01 v1(18.93,16.01)
  Bottom Layer w0.254: v1(18.93,16.01) 18.93,25.86 6.2,38.59 H1.2
PWMC: length 32.7
  Top Layer w0.254: CD1.23 v1(30.25,15.09)
  Bottom Layer w0.254: H2.1 44.76,38.59 30.25,24.09 v1(30.25,15.09)
PWMD: length 28.7
  Top Layer w0.254: CD1.15 29.99,20.29 44.73,35.03 44.73,36.56 45.47,37.29 47.32,37.29 H2.2
$1N2942: length 2.2
  Top Layer w0.363: C4.1 22.98,35.47 U1.7
$1N2945: length 2.7
  Top Layer w0.363: R4.2 28.97,36.64 27.8,35.47 U1.2
$1N2946: length 5.3
  Top Layer w0.363: U1.8 23.74,34.82 22.74,33.81 20.98,33.81 20.6,34.2 R1.1
$1N2947: length 20
  Top Layer w0.363: v1(22.53,37.6) 22.53,36.47 C4.2 22.8,36.44 23.12,36.12 U1.6 ; v1(9.32,40.09) L1.1
  Bottom Layer w0.363: v1(22.53,37.6) 20.04,40.09 v1(9.32,40.09)
$1N2949: length 5.8
  Top Layer w0.363: U1.1 28.93,34.82 R5.2 28.96,34.79 C5.1 30.86,32.99 R2.1
$1N2950: length 2
  Top Layer w0.762: PWR.2 23.26,11.67 23.27,11.66
$1N3073:
  vias: v1(19.56,49.03) v1(22.91,49.05) v1(23.03,46.62) v1(25.08,46.59) v1(25.26,49.03) v1(29.36,49.1) v1(29.34,46.59) v1(32.41,49.08)

## Copper pours and planes (outline as drawn; the poured copper is in the pictures)
5V on Top Layer: 19.66,19.46 19.66,18.4 19.69,18.37 24.08,18.37 24.08,19.03 24.1,19.46
5V on Top Layer: 29.47,16.8 29.47,17.89 25.39,17.89 25.39,17.09 25.5,17.05 27.08,17.05 27.33,16.8
12V on Top Layer: 19.64,15.57 22.15,15.57 22.15,12.58 19.64,12.58
12V on Top Layer: 27.09,25.47 27.09,20.72 29.61,20.72 29.57,25.47
12V on Top Layer: 27.09,14.68 29.61,14.68 29.61,12.58 27.09,12.58
12V on Top Layer: 19.61,25.73 19.61,21.65 22.13,21.65 22.09,25.73
12V on Bottom Layer: 27.08,23.52 29.57,23.52 29.57,12.6 27.08,12.6
12V on Bottom Layer: 19.64,23.43 22.13,23.43 22.13,12.53 19.64,12.53
GND on Top Layer: -5.74,66.28 55.1,66.28 55.1,-8.35 -5.74,-8.35
GND on Bottom Layer: -4.16,51.54 52.91,51.54 52.91,-1.95 -4.16,-1.95
AO1 on Top Layer: 11,22.82 14.86,22.82 14.86,20.96 11,20.96
AO1 on Bottom Layer: 6.23,24.64 11.97,24.64 12.65,23.96 12.65,20.96 11.03,20.96 11.03,22.87 6.25,22.87 6.23,22.89
$1N3073 on Top Layer: 18.72,49.9 18.72,44.6 25.96,44.6 25.96,48.21 28.11,48.21 28.11,44.58 33.24,44.58 33.24,49.9
$1N3073 on Bottom Layer: 18.7,49.93 18.7,44.63 25.94,44.63 25.94,48.25 28.09,48.25 28.09,44.62 33.22,44.62 33.22,49.93

Small or netless copper shapes (teardrops, artwork), in the pictures only: 85 on Top Layer, 34 on Bottom Layer

## Text on the board
Top Silkscreen Layer: - | + | OFF<->ON | TB6612 / 四路驱动板 | PWMA | AIN2 | AIN1 | AM1 | BM1 | BIN2 | BIN1 | PWMB | AM2 | BM2 | PWMC | CIN2 | CIN1 | AM3 | BM3 | DIN2 | PWMD | DIN1 | AM4 | BM4
